# Altium project MB1936.PrjPcb (part 7 of 8)

## Sheet Power_PMIC.SchDoc: Power PMIC
size A3; Date: Not used; ApprovedBy: Not used; CheckedBy: Not used; Author: Not used; CompanyName: STMicroelectronics; DrawnBy: Not used; Engineer: Not used; Organization: Not used; Address1: Not used; Address2: Not used; Address3: Not used; Address4: Not used; DocumentNumber: Not used; Revision: Not used; SheetNumber: 4; SheetTotal: 18; CurrentTime: Not used; CurrentDate: Not used; Time: Not used; DocumentFullPathAndName: Not used; DocumentName: Not used; ModifiedDate: Not used; ImagePath: Not used; ProjectName: Not used; Application_BuildNumber: Not used
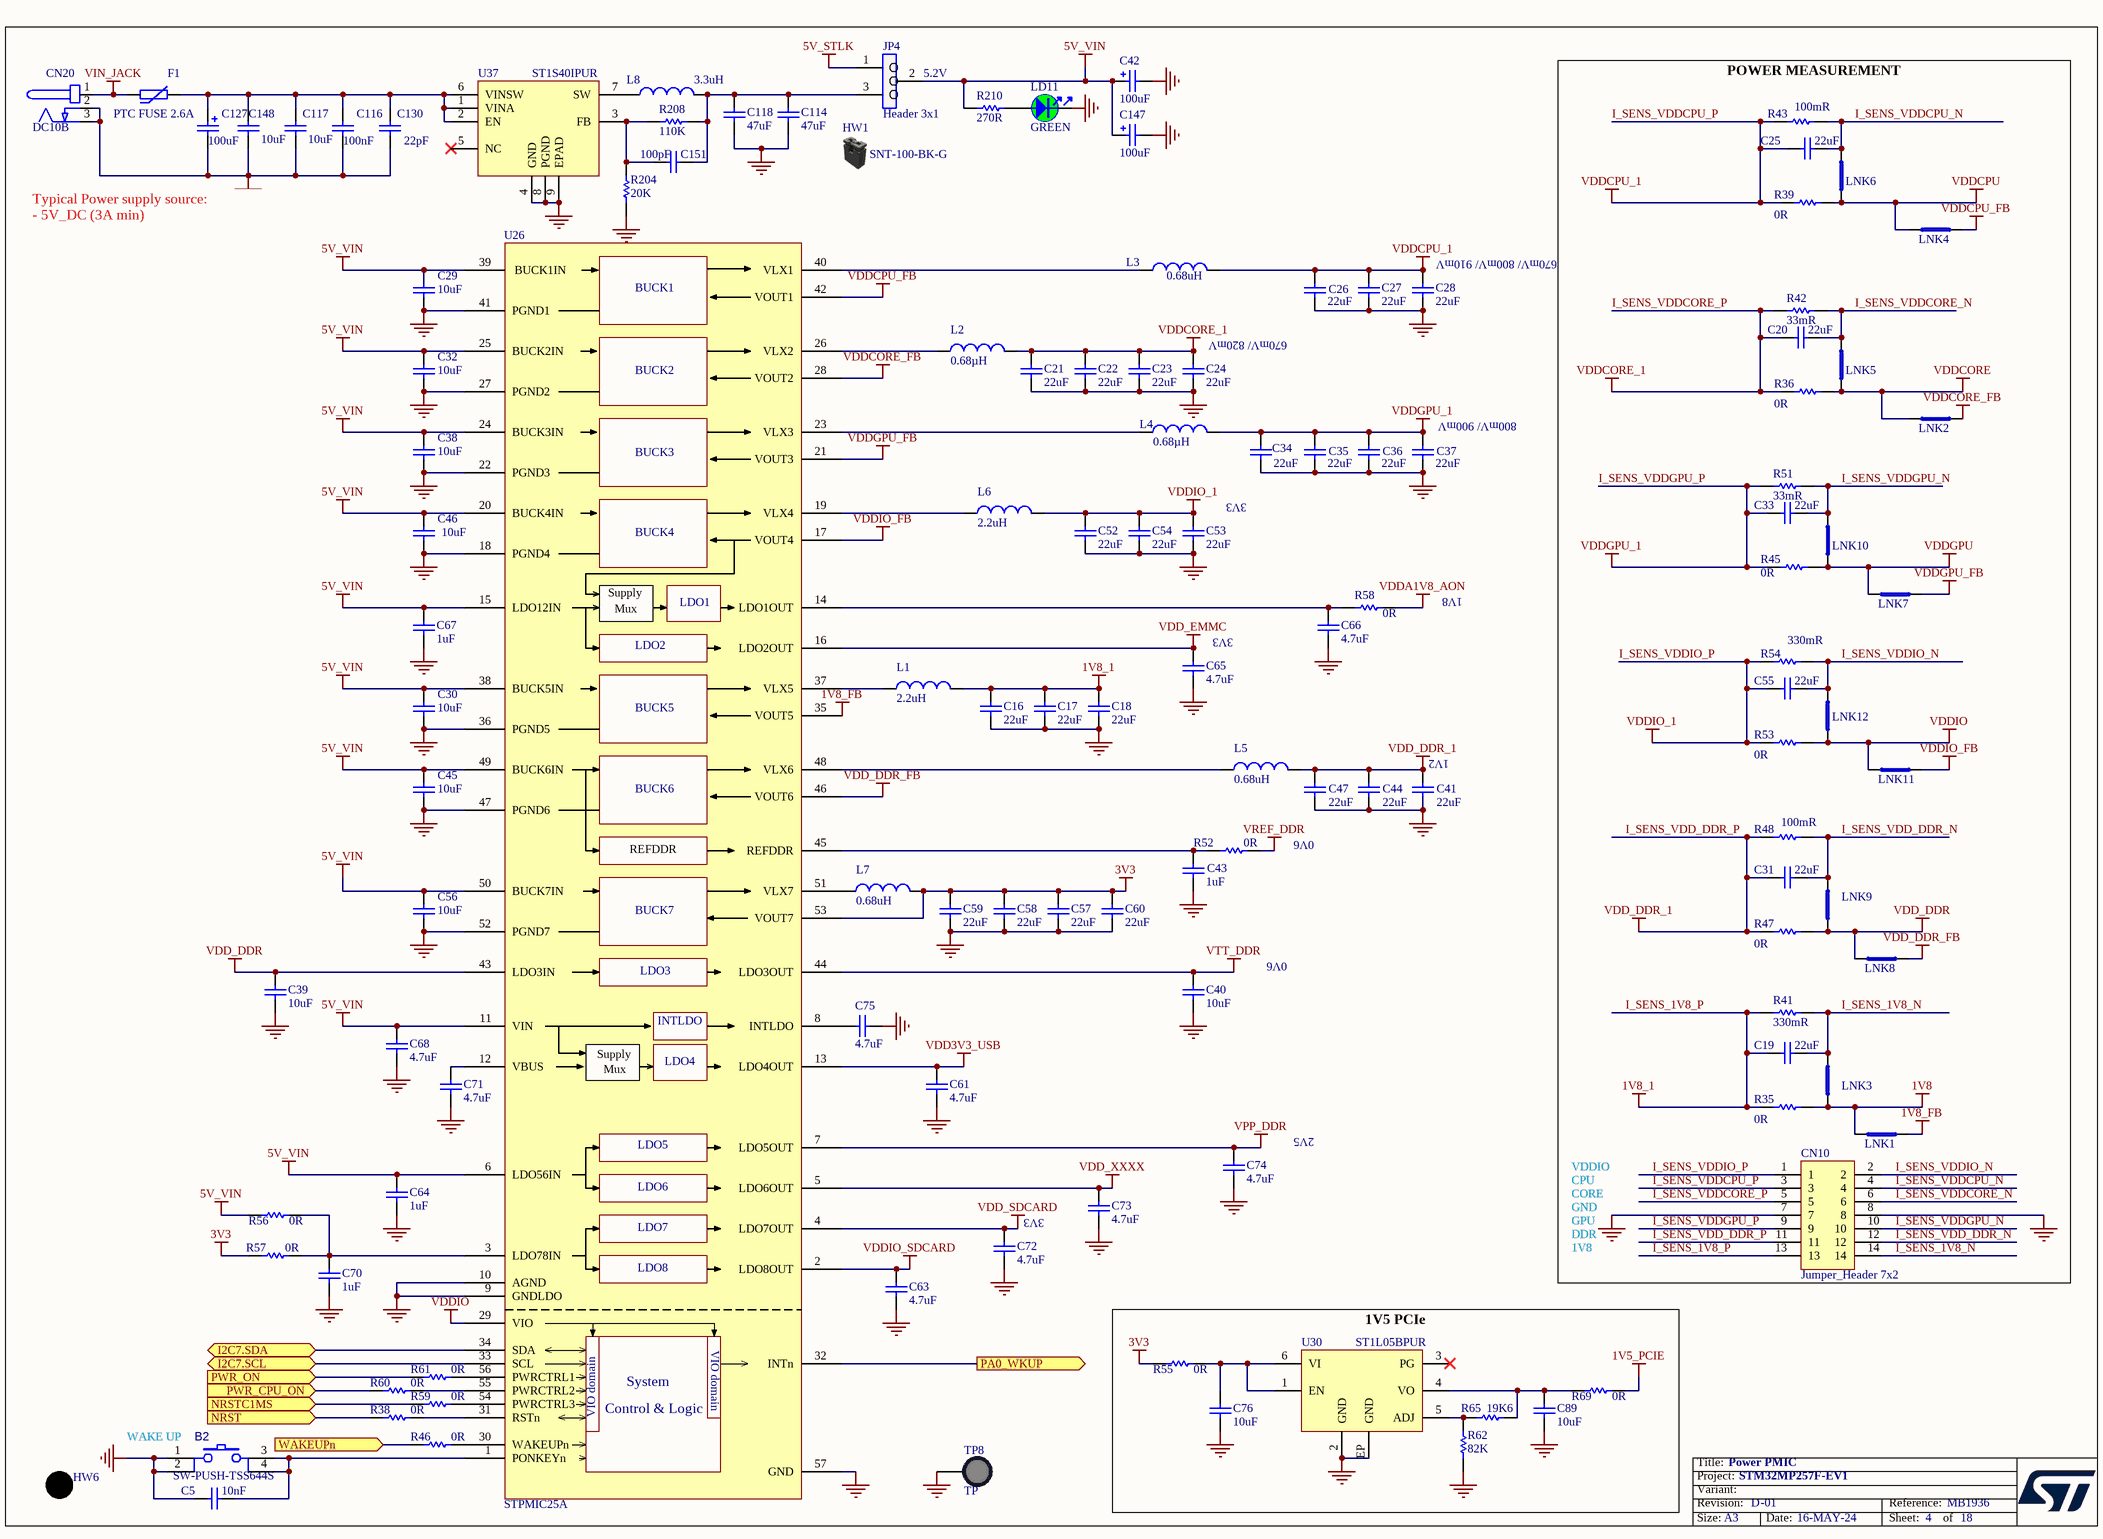
[diagram p16: Power_PMIC.SchDoc]

### Parts
B2  value SW-PUSH-TSS644S  [SWI_KNITTER_TSS644S]  (hidden comment: SW_PUSH_SMD)
C5  value 10nF  [C0402]  (hidden comment: Capacitor)
C16  value 22uF  [C0805]  (hidden comment: Capacitor)
C17  value 22uF  [C0805]  (hidden comment: Capacitor)
C18  value 22uF  [C0805]  (hidden comment: Capacitor)
C19  value 22uF  [C0603]  (hidden comment: Capacitor)
C20  value 22uF  [C0603]  (hidden comment: Capacitor)
C21  value 22uF  [C0603]  (hidden comment: Capacitor)
C22  value 22uF  [C0603]  (hidden comment: Capacitor)
C23  value 22uF  [C0603]  (hidden comment: Capacitor)
C24  value 22uF  [C0603]  (hidden comment: Capacitor)
C25  value 22uF  [C0603]  (hidden comment: Capacitor)
C26  value 22uF  [C0603]  (hidden comment: Capacitor)
C27  value 22uF  [C0603]  (hidden comment: Capacitor)
C28  value 22uF  [C0603]  (hidden comment: Capacitor)
C29  value 10uF  [C0603]  (hidden comment: Capacitor)
C30  value 10uF  [C0603]  (hidden comment: Capacitor)
C31  value 22uF  [C0603]  (hidden comment: Capacitor)
C32  value 10uF  [C0603]  (hidden comment: Capacitor)
C33  value 22uF  [C0603]  (hidden comment: Capacitor)
C34  value 22uF  [C0603]  (hidden comment: Capacitor)
C35  value 22uF  [C0603]  (hidden comment: Capacitor)
C36  value 22uF  [C0603]  (hidden comment: Capacitor)
C37  value 22uF  [C0603]  (hidden comment: Capacitor)
C38  value 10uF  [C0603]  (hidden comment: Capacitor)
C39  value 10uF  [C0402]  (hidden comment: Capacitor)
C40  value 10uF  [C0402]  (hidden comment: Capacitor)
C41  value 22uF  [C0603]  (hidden comment: Capacitor)
C42  value 100uF  [CPOL_TCJ-B_1210_H210]  (hidden comment: Cap_POL_TANA)
C43  value 1uF  [C0402]  (hidden comment: Capacitor)
C44  value 22uF  [C0603]  (hidden comment: Capacitor)
C45  value 10uF  [C0603]  (hidden comment: Capacitor)
C46  value 10uF  [C0603]  (hidden comment: Capacitor)
C47  value 22uF  [C0603]  (hidden comment: Capacitor)
C52  value 22uF  [C0805]  (hidden comment: Capacitor)
C53  value 22uF  [C0805]  (hidden comment: Capacitor)
C54  value 22uF  [C0805]  (hidden comment: Capacitor)
C55  value 22uF  [C0603]  (hidden comment: Capacitor)
C56  value 10uF  [C0603]  (hidden comment: Capacitor)
C57  value 22uF  [C0805]  (hidden comment: Capacitor)
C58  value 22uF  [C0805]  (hidden comment: Capacitor)
C59  value 22uF  [C0805]  (hidden comment: Capacitor)
C60  value 22uF  [C0805]  (hidden comment: Capacitor)
C61  value 4.7uF  [C0402]  (hidden comment: Capacitor)
C63  value 4.7uF  [C0402]  (hidden comment: Capacitor)
C64  value 1uF  [C0402]  (hidden comment: Capacitor)
C65  value 4.7uF  [C0402]  (hidden comment: Capacitor)
C66  value 4.7uF  [C0402]  (hidden comment: Capacitor)
C67  value 1uF  [C0402]  (hidden comment: Capacitor)
C68  value 4.7uF  [C0402]  (hidden comment: Capacitor)
C70  value 1uF  [C0402]  (hidden comment: Capacitor)
C71  value 4.7uF  [C0603]  (hidden comment: Capacitor)
C72  value 4.7uF  [C0402]  (hidden comment: Capacitor)
C73  value 4.7uF  [C0402]  (hidden comment: Capacitor)
C74  value 4.7uF  [C0402]  (hidden comment: Capacitor)
C75  value 4.7uF  [C0402]  (hidden comment: Capacitor)
C76  value 10uF  [C0603]  (hidden comment: Capacitor)
C89  value 10uF  [C0603]  (hidden comment: Capacitor)
C114  value 47uF  [C0805]  (hidden comment: Capacitor)
C116  value 100nF  [C0805_H0P85]  (hidden comment: Capacitor)
C117  value 10uF  [C0805]  (hidden comment: Capacitor)
C118  value 47uF  [C0805]  (hidden comment: Capacitor)
C127  value 100uF  [CPOL_WURTH_WCAP-ASLL_8X10P5]  (hidden comment: Cap_POL_TANA)
C130  value 22pF  [C0402]  (hidden comment: Capacitor)
C147  value 100uF  [CPOL_TCJ-B_1210_H210]  (hidden comment: Cap_POL_TANA)
C148  value 10uF  [C0805]  (hidden comment: Capacitor)
C151  value 100pF  [C0402]  (hidden comment: Capacitor)
CN10  value Jumper_Header 7x2  [CON_SAMTEC_TSW-107-07-X-D]  (hidden comment: Header 7x2)
CN20  DC10B  [CON_DC-POWER-SOCKET_CLIFF_FC68149_DC10B]
F1  value PTC FUSE 2.6A  [PTC_BEL-FUSE_1812_0ZCG0260FF2C]  (hidden comment: 0ZCG0260FF2C)
HW1  value SNT-100-BK-G  (hidden comment: Shunt Black 2.54mm)  (mechanical)
HW6  SW-CAP-KTSC-62K  (value not drawn)  (mechanical)
JP4  value Header 3x1  [CON_SAMTEC_TSW-103-07-F-S]  (hidden comment: Jumper_Header 3x1)
L1  value 2.2uH  [IND_2016_MURATA_LQM2MPN2R2NG0]  (hidden comment: Inductor)
L2  value 0.68µH  [IND_2520_TOKO_DFE252012P]  (hidden comment: Inductor)
L3  value 0.68uH  [IND_2016_MURATA_LQM2MPN2R2NG0]  (hidden comment: Inductor)
L4  value 0.68µH  [IND_2520_TOKO_DFE252012P]  (hidden comment: Inductor)
L5  value 0.68uH  [IND_2016_MURATA_LQM2MPN2R2NG0]  (hidden comment: Inductor)
L6  value 2.2uH  [IND_2016_MURATA_LQM2MPN2R2NG0]  (hidden comment: Inductor)
L7  value 0.68uH  [IND_2016_MURATA_LQM2MPN2R2NG0]  (hidden comment: Inductor)
L8  value 3.3uH  [IND_5040_WURTH_74404054033]  (hidden comment: Inductor)
LD11  value GREEN  [LED_0603_OSRAM_LG-Q396-PS-35_GREEN_1A2K_H0P4]  (hidden comment: LED_green)
LNK1  link_200  [LINK200]  (value not drawn)  (no BOM)
LNK2  link_200  [LINK200]  (value not drawn)  (no BOM)
LNK3  link_200  [LINK200]  (value not drawn)  (no BOM)
LNK4  link_200  [LINK200]  (value not drawn)  (no BOM)
LNK5  link_200  [LINK200]  (value not drawn)  (no BOM)
LNK6  link_200  [LINK200]  (value not drawn)  (no BOM)
LNK7  link_200  [LINK200]  (value not drawn)  (no BOM)
LNK8  link_200  [LINK200]  (value not drawn)  (no BOM)
LNK9  link_200  [LINK200]  (value not drawn)  (no BOM)
LNK10  link_200  [LINK200]  (value not drawn)  (no BOM)
LNK11  link_200  [LINK200]  (value not drawn)  (no BOM)
LNK12  link_200  [LINK200]  (value not drawn)  (no BOM)
R35  value 0R  [R0603]  (hidden comment: Resistor)
R36  value 0R  [R0603]  (hidden comment: Resistor)
R38  value 0R  [R0402]
R39  value 0R  [R0603]  (hidden comment: Resistor)
R41  value 330mR  [R0603]  (hidden comment: Resistor)
R42  value 33mR  [R0603]  (hidden comment: Resistor)
R43  value 100mR  [R0603]  (hidden comment: Resistor)
R45  value 0R  [R0603]  (hidden comment: Resistor)
R46  value 0R  [R0402]
R47  value 0R  [R0603]  (hidden comment: Resistor)
R48  value 100mR  [R0603]  (hidden comment: Resistor)
R51  value 33mR  [R0603]  (hidden comment: Resistor)
R52  value 0R  [R0402]  (hidden comment: Resistor)
R53  value 0R  [R0603]  (hidden comment: Resistor)
R54  value 330mR  [R0603]  (hidden comment: Resistor)
R55  value 0R  [R0603]  (hidden comment: Resistor)
R56  value 0R  [R0603]  (hidden comment: Resistor)
R57  value 0R  [R0402]  (hidden comment: Resistor)
R58  value 0R  [R0603]  (hidden comment: Resistor)
R59  value 0R  [R0402]
R60  value 0R  [R0402]
R61  value 0R  [R0402]
R62  value 82K  [R0402]  (hidden comment: Resistor)
R65  value 19K6  [R0402]  (hidden comment: Resistor)
R69  value 0R  [R0603]  (hidden comment: Resistor)
R204  value 20K  [R0402]  (hidden comment: Resistor)
R208  value 110K  [R0402]  (hidden comment: Resistor)
R210  value 270R  [R0402]  (hidden comment: Resistor)
TP8  value TP  [TP_PTH-1P02MM_TEST-TERMINAL_RS_101-2391_BLACK]  (hidden comment: Test_pin_conn_black)
U26  value STPMIC25A  [ICC_QFN56-EPAD_6P5X6P5_P040]  (hidden comment: STPMIC2)
U30  ST1L05BPUR  [ICC_DFN6-EPAD_3X3_P095]
U37  ST1S40IPUR  [ICC_VFQFPN8-EPAD_4X4_P080]

### Ports
I2C7.SCL (bidir), I2C7.SDA (bidir), NRST (in), NRSTC1MS (in), PA0_WKUP (out), PWR_CPU_ON (in), PWR_ON (in), WAKEUPn (in)

### Nets
1V5_PCIE: R69.2
1V8: LNK1.2 LNK3.2 R35.2
1V8_FB: LNK1.1 U26.35(VOUT5)
3V3: C57.2 C58.2 C59.2 C60.2 L7.2 R55.1 R57.1 U26.53(VOUT7)
5V_STLK: JP4.1
5V_VIN: C29.2 C30.2 C32.2 C38.2 C42.1 C45.2 C46.2 C56.2 C64.2 C67.2 C68.2 C147.1 JP4.2 R56.1 R210.2 U26.6(LDO56IN) U26.11(VIN) U26.15(LDO12IN) U26.20(BUCK4IN) U26.24(BUCK3IN) U26.25(BUCK2IN) U26.38(BUCK5IN) U26.39(BUCK1IN) U26.49(BUCK6IN) U26.50(BUCK7IN)
GND: B2.1 B2.2 C5.1 C16.1 C17.1 C18.1 C21.1 C22.1 C23.1 C24.1 C26.1 C27.1 C28.1 C29.1 C30.1 C32.1 C34.1 C35.1 C36.1 C37.1 C38.1 C39.1 C40.1 C41.1 C42.2 C43.2 C44.1 C45.1 C46.1 C47.1 C52.1 C53.1 C54.1 C56.1 C57.1 C58.1 C59.1 C60.1 C61.1 C63.2 C64.1 C65.2 C66.1 C67.1 C68.1 C70.1 C71.1 C72.2 C73.2 C74.2 C75.2 C76.1 C89.1 C114.1 C116.1 C117.1 C118.1 C127.2 C130.1 C147.2 C148.1 CN10.7 CN10.8 CN20.2 CN20.3 LD11.2 R62.1 R204.1 TP8.1 U26.9(GNDLDO) U26.10(AGND) U26.18(PGND4) U26.22(PGND3) U26.27(PGND2) U26.36(PGND5) U26.41(PGND1) U26.47(PGND6) U26.52(PGND7) U26.57(GND) U30.2(GND) U30.EP(GND) U37.4(GND) U37.8(PGND) U37.9(EPAD)
I_SENS_1V8_P: C16.2 C17.2 C18.2 C19.2 CN10.13 L1.2 R35.1 R41.1  [also labelled 1V8_1]
I_SENS_VDD_DDR_P: C31.2 C41.2 C44.2 C47.2 CN10.11 L5.2 R47.1 R48.1  [also labelled VDD_DDR_1]
I_SENS_VDDCORE_P: C20.2 C21.2 C22.2 C23.2 C24.2 CN10.5 L2.2 R36.1 R42.1  [also labelled VDDCORE_1]
I_SENS_VDDCPU_P: C25.2 C26.2 C27.2 C28.2 CN10.3 L3.2 R39.1 R43.1  [also labelled VDDCPU_1]
I_SENS_VDDGPU_P: C33.2 C34.2 C35.2 C36.2 C37.2 CN10.9 L4.2 R45.1 R51.1  [also labelled VDDGPU_1]
I_SENS_VDDIO_P: C52.2 C53.2 C54.2 C55.2 CN10.1 L6.2 R53.1 R54.1  [also labelled VDDIO_1]
VDD3V3_USB: C61.2 U26.13(LDO4OUT)
VDD_DDR: C39.2 LNK8.2 LNK9.2 R47.2 U26.43(LDO3IN)
VDD_DDR_FB: LNK8.1 U26.46(VOUT6)
VDD_EMMC: C65.1 U26.16(LDO2OUT)
VDD_SDCARD: C72.1 U26.4(LDO7OUT)
VDD_XXXX: C73.1 U26.5(LDO6OUT)
VDDA1V8_AON: R58.2
VDDCORE: LNK2.2 LNK5.1 R36.2
VDDCORE_FB: LNK2.1 U26.28(VOUT2)
VDDCPU: LNK4.1 LNK6.1 R39.2
VDDCPU_FB: LNK4.2 U26.42(VOUT1)
VDDGPU: LNK7.2 LNK10.1 R45.2
VDDGPU_FB: LNK7.1 U26.21(VOUT3)
VDDIO: LNK11.2 LNK12.2 R53.2 U26.29(VIO)
VDDIO_FB: LNK11.1 U26.17(VOUT4)
VDDIO_SDCARD: C63.1 U26.2(LDO8OUT)
VIN_JACK: CN20.1 F1.1
VPP_DDR: C74.1 U26.7(LDO5OUT)
VREF_DDR: R52.2
VTT_DDR: C40.2 U26.44(LDO3OUT)
I2C7.SCL: U26.33(SCL) ; port I2C7.SCL
I2C7.SDA: U26.34(SDA) ; port I2C7.SDA
I_SENS_1V8_N: C19.1 CN10.14 LNK3.1 R41.2
I_SENS_VDD_DDR_N: C31.1 CN10.12 LNK9.1 R48.2
I_SENS_VDDCORE_N: C20.1 CN10.6 LNK5.2 R42.2
I_SENS_VDDCPU_N: C25.1 CN10.4 LNK6.2 R43.2
I_SENS_VDDGPU_N: C33.1 CN10.10 LNK10.2 R51.2
I_SENS_VDDIO_N: C55.1 CN10.2 LNK12.1 R54.2
NRST: R38.1 ; port NRST
NRSTC1MS: R59.1 ; port NRSTC1MS
PA0_WKUP: U26.32(INTn) ; port PA0_WKUP
PWR_CPU_ON: R60.1 ; port PWR_CPU_ON
PWR_ON: R61.1 ; port PWR_ON
WAKEUPn: R46.1 ; port WAKEUPn
NetB2_3: B2.3 B2.4 C5.2 U26.1(PONKEYn)
NetC43_1: C43.1 R52.1 U26.45(REFDDR)
NetC66_2: C66.2 R58.1 U26.14(LDO1OUT)
NetC70_2: C70.2 R56.2 R57.2 U26.3(LDO78IN)
NetC71_2: C71.2 U26.12(VBUS)
NetC75_1: C75.1 U26.8(INTLDO)
NetC76_2: C76.2 R55.2 U30.1(EN) U30.6(VI)
NetC89_2: C89.2 R65.2 R69.1 U30.4(VO)
NetC114_2: C114.2 C118.2 C151.1 JP4.3 L8.2 R208.1
NetC116_2: C116.2 C117.2 C127.1 C130.2 C148.2 F1.2 U37.1(VINA) U37.2(EN) U37.6(VINSW)
NetC151_2: C151.2 R204.2 R208.2 U37.3(FB)
NetL1_1: L1.1 U26.37(VLX5)
NetL2_1: L2.1 U26.26(VLX2)
NetL3_1: L3.1 U26.40(VLX1)
NetL4_1: L4.1 U26.23(VLX3)
NetL5_1: L5.1 U26.48(VLX6)
NetL6_1: L6.1 U26.19(VLX4)
NetL7_1: L7.1 U26.51(VLX7)
NetL8_1: L8.1 U37.7(SW)
NetLD11_1: LD11.1 R210.1
NetR38_2: R38.2 U26.31(RSTn)
NetR46_2: R46.2 U26.30(WAKEUPn)
NetR59_2: R59.2 U26.54(PWRCTRL3)
NetR60_2: R60.2 U26.55(PWRCTRL2)
NetR61_2: R61.2 U26.56(PWRCTRL1)
NetR62_2: R62.2 R65.1 U30.5(ADJ)

Not connected (* = marked no-connect by the designer): U30 3(PG)*; U37 5(NC)*

### Notes on the sheet
- 5.2V
- Typical Power supply source:
  - 5V_DC (3A min)
- (near C28) 670mV/ 800mV/ 910mV
- (near C24) 670mV/ 820mV
- (near C37) 800mV/ 900mV
- 3V3
- 1V8
- (near C65) 3V3
- (near C41) 1V2
- 0V6
- 2V5
- (near C72) 3V3
- VDDIO
- CPU
- GND
- CORE
- POWER MEASUREMENT
- DDR
- GPU
- (near B2) WAKE UP
- 1V5 PCIe
- Title:
- Project:
- Size:
- Revision:
- Variant:
- A3
- -
- Date:
- Reference:
- Sheet:
- of
- (in symbol MCD-03000) BUCK1; BUCK2; BUCK3; BUCK4; Supply; LDO1; Mux; LDO2; BUCK5; BUCK6; BUCK7; LDO3; LDO4; LDO5; LDO6; LDO7; LDO8; VIO domain; System; Control & Logic

### Library data of the parts
B2 = MCD-02417: Push Button, NO, 0.05A, 12V, 2.6N, SMD, 9.0x6.2mm, T=7.3mm, changeable caps KTSC-6xx; Part_Type: Misc; Manufacturer_Part_Number: TSS644S; Manufacturer: KNITTER-SWITCH; Part_Preference: Recommended; Component_Country_Of_Origin: China; ShowFields: YES; ID: 4523; Internal_Part_Number: MCD-02417; Status: Released; ComponentLink1URL: http://tunmcdsvn.tun.st.com/Component_Documentation_Library/Trunk/Misc/KNITTER_TSS6x_Series; Order_Code_Digikey: N/A; Order_Code_Farnell: N/A; Order_Code_RS: N/A; Package: 9.0x6.2mm
C5 = MCD-02198: Capacitor, MLCC, 10nF, 50V, X7R, +/-10%, 0402, T=0.5mm; Manufacturer_Part_Number: CC0402KRX7R9BB103; Manufacturer: YAGEO; Part_Preference: Recommended; Order_Code_RS: 6169644; Component_Country_Of_Origin: China; ShowFields: YES; ID: 4298; Internal_Part_Number: MCD-02198; Status: Checked; Part_Type: Capacitor; Package: 0402; ComponentLink1URL: http://tunmcdsvn.tun.st.com/Component_Documentation_Library/Trunk/Capacitor/YAGEO_X7R_Series; Order_Code_Digikey: N/A; Order_Code_Farnell: N/A
C16-C18 C52-C54 C57-C60 = MCD-03139: Capacitor, MLCC, 22uF, 10V, X5R, +/-20%, 0805, T=1,25mm; Part_Preference: Recommended; Manufacturer: MURATA; Manufacturer_Part_Number: GRM21BR61A226ME51L; ShowFields: YES; ID: 5255; Internal_Part_Number: MCD-03139; Status: New; Part_Type: Capacitor; Package: 0805; ComponentLink1URL: http://tunmcdsvn.tun.st.com/Component_Documentation_Library/Trunk/Capacitor/MURATA_GRM_Series; Order_Code_Digikey: 490-10511-2-ND; Order_Code_Farnell: 2494270; Order_Code_RS: N/A
C19 C20 C22-C26 C31 C33-C37 C41 C44 C47 C55 = MCD-00100: Capacitor, MLCC, 22uF, 6V3, X5R, +/-20%, 0603, T=0,8mm; Manufacturer_Part_Number: GRM188R60J226MEA0J; Manufacturer: MURATA; Part_Preference: Recommended; Component_Country_Of_Origin: Japan; ID: 2766; ShowFields: YES; Internal_Part_Number: MCD-00100; Status: Released; Part_Type: Capacitor; Package: 0603; ComponentLink1Description: Part_Information; ComponentLink1URL: http://tunmcdsvn.tun.st.com/Component_Documentation_Library/Trunk/Capacitor/MURATA_GRM_Series; Order_Code_Digikey: 490-7612-2-ND; Order_Code_Farnell: N/A; Order_Code_RS: N/A; Alternate_Manufacturer: N/A; Alternate_Manufacturer_Part_Number: N/A
C21 C27 C28 = MCD-00100: Capacitor, MLCC, 22uF, 6V3, X5R, +/-20%, 0603, T=0,8mm; Part_Preference: Recommended; Manufacturer: MURATA; Manufacturer_Part_Number: GRM188R60J226MEA0J; Component_Country_Of_Origin: Japan; ID: 2766; ShowFields: YES; Internal_Part_Number: MCD-00100; Status: Released; Part_Type: Capacitor; Package: 0603; ComponentLink1URL: http://tunmcdsvn.tun.st.com/Component_Documentation_Library/Trunk/Capacitor/MURATA_GRM_Series; Order_Code_Digikey: 490-7612-2-ND; Order_Code_Farnell: N/A; Order_Code_RS: N/A; ComponentLink1Description: Part_Information; Alternate_Manufacturer: N/A; Alternate_Manufacturer_Part_Number: N/A
C29 C30 C32 C38 C45 C46 C56 = MCD-00099: Capacitor, MLCC, 10uF, 10V, X5R, +/-10%, 0603, T=0,8mm; Manufacturer_Part_Number: GRM188R61A106KE69D; Manufacturer: MURATA; Part_Preference: Recommended; Order_Code_RS: 170-6168; Component_Country_Of_Origin: Japan; ID: 2770; ShowFields: YES; Internal_Part_Number: MCD-00099; Status: Released; Part_Type: Capacitor; Package: 0603; ComponentLink1Description: Part_Information; ComponentLink1URL: http://tunmcdsvn.tun.st.com/Component_Documentation_Library/Trunk/Capacitor/MURATA_GRM_Series; Order_Code_Digikey: 490-10474-1-ND; Order_Code_Farnell: 2494233; Alternate_Manufacturer: N/A; Alternate_Manufacturer_Part_Number: N/A
C39 C40 = MCD-03140: Capacitor, MLCC, 10uF, 6.3V, X5R, +/-20%, 0402, T=0.5mm; Part_Preference: Recommended; Manufacturer: MURATA; Manufacturer_Part_Number: GRM155R60J106ME05D; ShowFields: YES; ID: 5256; Internal_Part_Number: MCD-03140; Status: New; Part_Type: Capacitor; Package: 0402; ComponentLink1URL: http://tunmcdsvn.tun.st.com/Component_Documentation_Library/Trunk/Capacitor/MURATA_GRM_Series; Order_Code_Digikey: 490-GRM155R60J106ME05DTR-ND; Order_Code_Farnell: 3784428; Order_Code_RS: N/A
C42 C147 = MCD-01796: Capacitor, Tantalum, 100uF, 6V3, 40mR, +/-20%,  Type_B (3528 metric), T=1.9mm; Part_Preference: Recommended; Manufacturer: AVX; Manufacturer_Part_Number: TCJB107M006R0040; Component_Country_Of_Origin: Lanskroun; ShowFields: YES; ID: 3896; Revision: July-2002: Re-released for DXP Platform.; Internal_Part_Number: MCD-01796; Status: Released; Part_Type: Capacitor; Package: 3528 (metric); ComponentLink1URL: http://tunmcdsvn.tun.st.com/Component_Documentation_Library/Trunk/Capacitor/AVX_TCJ_Series; Order_Code_Digikey: 478-9994-2-ND; Order_Code_Farnell: 2728622; Order_Code_RS: N/A
C43 = MCD-01722: Capacitor, MLCC, 1uF, 10V, X5R, +/-10%, 0402, T=0.5mm; Part_Preference: Recommended; Manufacturer: YAGEO; Manufacturer_Part_Number: CC0402KRX5R6BB105; Component_Country_Of_Origin: China; ID: 3822; ShowFields: YES; Internal_Part_Number: MCD-01722; Status: Released; Part_Type: Capacitor; Alternate_Manufacturer: N/A; Alternate_Manufacturer_Part_Number: N/A; Package: 0402; ComponentLink1URL: http://tunmcdsvn.tun.st.com/Component_Documentation_Library/Trunk/Capacitor/YAGEO_X5R_Series; Order_Code_Digikey: 311-1439-1-ND; Order_Code_Farnell: 1458896; Order_Code_RS: N/A
C61 C63 C65 C66 C68 C72-C75 = MCD-01356: Capacitor, MLCC, 4.7uF, 6V3, X5R, +/-20%, 0402, T=0.5mm; Manufacturer_Part_Number: GRM155R60J475ME47; Manufacturer: MURATA; Part_Preference: Recommended; Order_Code_RS: 814-5230; Component_Country_Of_Origin: Japan; ShowFields: YES; ID: 3456; Internal_Part_Number: MCD-01356; Status: Released; Part_Type: Capacitor; Package: 0402; ComponentLink1URL: http://tunmcdsvn.tun.st.com/Component_Documentation_Library/Trunk/Capacitor/MURATA_GRM_Series; Order_Code_Digikey: 490-5915-1-ND; Order_Code_Farnell: 2666407
C64 C67 C70 = MCD-00095: Capacitor, MLCC, 1uF, 25V, X5R, +/-10%, 0402, T=0.5mm; Part_Preference: Recommended; Manufacturer: MURATA; Manufacturer_Part_Number: GRM155R61E105KA12; Order_Code_RS: 846-7287; Component_Country_Of_Origin: Japan; ShowFields: YES; ID: 2772; Internal_Part_Number: MCD-00095; Status: Released; Part_Type: Capacitor; Package: 0402; ComponentLink1URL: http://tunmcdsvn.tun.st.com/Component_Documentation_Library/Trunk/Capacitor/MURATA_GRM_Series; Order_Code_Digikey: 490-10017-1-ND; Order_Code_Farnell: 2218855
C71 = MCD-00097: Capacitor, MLCC, 4.7uF, 16V, X5R, +/-20%, 0603, T=0.8mm; Part_Preference: Recommended; Manufacturer: MURATA; Manufacturer_Part_Number: GRM188R61C475KE11; Component_Country_Of_Origin: Japan; ShowFields: YES; ID: 2767; Internal_Part_Number: MCD-00097; Status: Released; Part_Type: Capacitor; Package: 0603; ComponentLink1URL: http://tunmcdsvn.tun.st.com/Component_Documentation_Library/Trunk/Capacitor/MURATA_GRM_Series; Order_Code_Digikey: 490-10730-1-ND; Order_Code_Farnell: N/A; Order_Code_RS: N/A
C76 C89 = MCD-00099: Capacitor, MLCC, 10uF, 10V, X5R, +/-10%, 0603, T=0.8mm; Part_Preference: Recommended; Manufacturer: MURATA; Manufacturer_Part_Number: GRM188R61A106KE69D; Order_Code_RS: 170-6168; Component_Country_Of_Origin: Japan; ShowFields: YES; ID: 2770; Internal_Part_Number: MCD-00099; Status: Released; Part_Type: Capacitor; Package: 0603; ComponentLink1URL: http://tunmcdsvn.tun.st.com/Component_Documentation_Library/Trunk/Capacitor/MURATA_GRM_Series; Order_Code_Digikey: 490-10474-1-ND; Order_Code_Farnell: 2494233
C114 C118 = MCD-00204: Capacitor, MLCC, 47uF, 10V, X5R, +/-20%, 0805, T=1,25mm; Part_Preference: Recommended; Manufacturer: MURATA; Manufacturer_Part_Number: GRM21BR61A476ME15K; Component_Country_Of_Origin: Japan; ID: 2664; ShowFields: YES; Internal_Part_Number: MCD-00204; Status: Checked; Part_Type: Capacitor; Alternate_Manufacturer: N/A; Alternate_Manufacturer_Part_Number: N/A; Package: 0805; ComponentLink1Description: Part_Information; ComponentLink1URL: http://tunmcdsvn.tun.st.com/Component_Documentation_Library/Trunk/Capacitor/MURATA_GRM_Series; Order_Code_Digikey: GRM21BR61A476ME15K-ND; Order_Code_Farnell: N/A; Order_Code_RS: N/A
C116 = MCD-01525: Capacitor, MLCC, 100nF, 50V, X7R, 10%, 0805, T=0,85mm; BMS_Part_Number: 9142249; Part_Preference: Recommended; Manufacturer: YAGEO; Manufacturer_Part_Number: CC0805KRX7R9BB104; Order_Code_RS: 669-8842; Component_Country_Of_Origin: China; ID: 3625; ShowFields: YES; Internal_Part_Number: MCD-01525; Status: Released; Part_Type: Capacitor; Package: 0805; ComponentLink1Description: Part_Information; ComponentLink1URL: http://tunmcdsvn.tun.st.com/Component_Documentation_Library/Trunk/Capacitor/YAGEO_X7R_Series; Order_Code_Digikey: 311-1140-1-ND; Order_Code_Farnell: 3019949; Alternate_Manufacturer: N/A; Alternate_Manufacturer_Part_Number: N/A
C117 C148 = MCD-00014: Capacitor, MLCC, 10uF, 25V, X5R, +/-10%, 0805, T=0,85mm; Part_Preference: Recommended; Manufacturer: YAGEO; Manufacturer_Part_Number: CC0805KRX5R8BB106; Full_Alternate_Internal_Part_Number: MCD-02385; Component_Country_Of_Origin: China; ID: 2468; ShowFields: YES; Internal_Part_Number: MCD-00014; Status: Released; Part_Type: Capacitor; Package: 0805; ComponentLink1Description: Part_Information; ComponentLink1URL: http://tunmcdsvn.tun.st.com/Component_Documentation_Library/Trunk/Capacitor/YAGEO_X5R_Series; Order_Code_Digikey: 311-3503-1-ND; Order_Code_Farnell: N/A; Order_Code_RS: N/A; Alternate_Manufacturer: N/A; Alternate_Manufacturer_Part_Number: N/A
C127 = MCD-01683: Capacitor,Electrolytic,100uF,35V, 20%, SMT, D=8mm, T=10.5mm; Part_Preference: Recommended; Manufacturer: WURTH ELEKTRONIK; Manufacturer_Part_Number: 865060553006; Order_Code_RS: 839-5753; Component_Country_Of_Origin: Unknown; ID: 3783; ShowFields: YES; Revision: July-2002: Re-released for DXP Platform.; Internal_Part_Number: MCD-01683; Status: Released; Part_Type: Capacitor; Package: 8x10.5mm; ComponentLink1Description: Part_Information; ComponentLink1URL: http://tunmcdsvn.tun.st.com/Component_Documentation_Library/Trunk/Capacitor/WURTH-ELEKTRONIC_ASLL_Series; Order_Code_Digikey: 732-8586-1-ND; Order_Code_Farnell: 2466219; Alternate_Manufacturer: N/A; Alternate_Manufacturer_Part_Number: N/A
C130 = MCD-01995: Capacitor, MLCC, 22pF, 50V, C0G, 5%, 0402, T=0,5mm; Part_Preference: Recommended; Manufacturer: TDK; Manufacturer_Part_Number: C1005NP01H220J050BA; Component_Country_Of_Origin: Unknown; ID: 4095; ShowFields: YES; Internal_Part_Number: MCD-01995; Status: Released; Part_Type: Capacitor; Package: 0402; ComponentLink1Description: Part_Information; ComponentLink1URL: http://tunmcdsvn.tun.st.com/Component_Documentation_Library/Trunk/Capacitor/TDK_C_Series; Order_Code_Digikey: 445-13793-1-ND; Alternate_Manufacturer: N/A; Alternate_Manufacturer_Part_Number: N/A; Order_Code_Farnell: 3416050RL; Order_Code_RS: N/A
C151 = MCD-00205: Capacitor,MLCC,100pF,50V,NPO,+/-5%,0402,T=0,5mm; Manufacturer_Part_Number: CC0402JRNPO9BN101; Manufacturer: YAGEO; Part_Preference: Recommended; Fitted: YES; Component_Country_Of_Origin: China; ID: 2658; Internal_Part_Number: MCD-00205; Status: Released; Part_Type: Capacitor; Package: 0402; ComponentLink1Description: Part_Information; ComponentLink1URL: http://tunmcdsvn.tun.st.com/Component_Documentation_Library/Trunk/Capacitor/YAGEO_NP0_Series; Order_Code_Digikey: 311-1024-1-ND; Order_Code_Farnell: 3019226RL; Order_Code_RS: N/A; Alternate_Manufacturer: N/A; Alternate_Manufacturer_Part_Number: N/A; ShowFields: YES
CN10 = MCD-02123: Header, 7x2, 2,54mm, VR, TH, Height 5.84mm/2.54mm; Part_Type: Connector; Part_Preference: Recommended; Manufacturer: SAMTEC; Manufacturer_Part_Number: TSW-107-07-G-D; Component_Country_Of_Origin: China, Costa Rica, Malaysia, United States, Vietnam; ID: 4223; ShowFields: YES; Internal_Part_Number: MCD-02123; Status: Checked; Alternate_Manufacturer: N/A; Alternate_Manufacturer_Part_Number: N/A; ComponentLink1URL: http://tunmcdsvn.tun.st.com/Component_Documentation_Library/Trunk/Connector/SAMTEC_TSW_Series/; Order_Code_Digikey: N/A; Order_Code_Farnell: N/A; Order_Code_RS: N/A; ComponentLink1Description: Part_Information
CN20 = MCD-00173: DC-Power-Jack, 2.5mm, 5A, RA, TH; BMS_Part_Number: 9087803; Part_Preference: Recommended; Part_Type: Connector; Manufacturer: CLIFF; Value: Jack_DC-Power_DC10B; Component_Country_Of_Origin: Taiwan; ID: 2695; ShowFields: YES; Internal_Part_Number: MCD-00173; Status: Released; Manufacturer_Part_Number: DC10B; ComponentLink1Description: Part_Information; ComponentLink1URL: http://tunmcdsvn.tun.st.com/Component_Documentation_Library/Trunk/Connector/CLIFF_DC_Series/; Alternate_Manufacturer: N/A; Alternate_Manufacturer_Part_Number: N/A; Order_Code_Digikey: N/A; Order_Code_Farnell: 224960; Order_Code_RS: N/A
F1 = MCD-00624: SMD, PTC resettable fuse, IH:2.6A, IT:5A, Vdc_max:8V, Rmax:47mohm, BELFUSE; Part_Preference: Recommended; Part_Type: Misc; Component_Country_Of_Origin: Unknown; ID: 3118; ShowFields: YES; Internal_Part_Number: MCD-00624; Status: Checked; Manufacturer: BELFUSE; Manufacturer_Part_Number: 0ZCG0260FF2C; ComponentLink1Description: Part_Information; ComponentLink1URL: http://tunmcdsvn.tun.st.com/Component_Datasheet_Library/Trunk/Misc/BELFUSE_FUSE_PTC_0ZCG_series
HW1 = MCD-00043: SHUNT 2.54mm BLACK; Part_Type: Misc; Part_Preference: Recommended; Manufacturer: SAMTEC; Full_Alternate_Internal_Part_Number: MCD-02388; Component_Country_Of_Origin: China, Costa Rica, Malaysia, United States, Vietnam; ShowFields: YES; ID: 2551; Internal_Part_Number: MCD-00043; Status: Released; Manufacturer_Part_Number: SNT-100-BK-G; ComponentLink1URL: http://tunmcdsvn.tun.st.com/Component_Datasheet_Library/Trunk/Connectors/Samtec_Shunt_Jumper_SNT100
HW6 = MCD-02420: Black round cap for TSS6x series; Part_Type: Mechanical; Part_Preference: Recommended; Manufacturer: KNITTER-SWITCH; Component_Country_Of_Origin: China; ID: 4526; ShowFields: YES; Value: SW-CAP-KTSC-62K; Order_code_Digikey: N/A; Order_code_Farnell: N/A; Order_code_RS: N/A; Status: Released; ComponentLink1URL: http://tunmcdsvn.tun.st.com/Component_Documentation_Library/Trunk/Mechanical/KNITTER-SWITCH_KTSC-62_Series; Internal_Part_Number: MCD-02420; Manufacturer_Part_Number: KTSC-62K; Alternate_Manufacturer: N/A; Alternate_Manufacturer_Part_Number: N/A
JP4 = MCD-00111: Header, 3x1, 2.54mm, VR, TH, T=5.84mm/2.54mm; Part_Type: Connector; Part_Preference: Recommended; Manufacturer: SAMTEC; Manufacturer_Part_Number: TSW-103-07-F-S; Order_Code_RS: 161-2248; Component_Country_Of_Origin: China, Costa Rica, Malaysia, United States, Vietnam; ShowFields: YES; ID: 2760; Internal_Part_Number: MCD-00111; Status: Released; ComponentLink1URL: http://tunmcdsvn.tun.st.com/Component_Documentation_Library/Trunk/Connector/SAMTEC_TSW_Series/; Order_Code_Digikey: SAM8995-ND; Order_Code_Farnell: 2505043
L1 L6 = MCD-03143: Inductor, 2.2uH, +/-20%, Itemp= 1700mA, Isat= 2400mA, 0R140, 0806, T=1mm; Part_Preference: Recommended; Manufacturer: MURATA; Manufacturer_Part_Number: DFE201610E-2R2M=P2; ShowFields: YES; ID: 5259; Internal_Part_Number: MCD-03143; Status: New; Part_Type: Inductor; Package: 0806; ComponentLink1URL: http://tunmcdsvn.tun.st.com/Component_Documentation_Library/Trunk; Order_Code_Digikey: 490-17728-2-ND -; Order_Code_Farnell: N/A; Order_Code_RS: N/A
L2 L4 = MCD-03142: Inductor, 0.68uH, +/-20%, Itemp= 3900mA, Isat= 5400mA, 0R031, 1008, T=1.2mm; Part_Preference: Recommended; Manufacturer: MURATA; Manufacturer_Part_Number: DFE252012F-R68M=P2; ShowFields: YES; ID: 5258; Internal_Part_Number: MCD-03142; Status: New; Part_Type: Inductor; Package: 1008; ComponentLink1URL: http://tunmcdsvn.tun.st.com/Component_Documentation_Library/Trunk/Inductor/MURATA_DFE252012F; Order_Code_Digikey: 490-13044-2-ND; Order_Code_Farnell: N/A; Order_Code_RS: N/A
L3 L5 L7 = MCD-03141: Inductor, 0.68uH, +/-20%, Itemp= 3100mA, Isat= 4300mA, 0R043, 0806, T=1mm; Part_Preference: Recommended; Manufacturer: MURATA; Manufacturer_Part_Number: DFE201610E-R68M=P2; ShowFields: YES; ID: 5257; Internal_Part_Number: MCD-03141; Status: New; Part_Type: Inductor; Package: 0806; ComponentLink1URL: http://tunmcdsvn.tun.st.com/Component_Documentation_Library/Trunkhttp://tunmcdsvn.tun.st.com/Component_Documentation_Library/Trunk/Inductor/MURATA_DFE201612P_Series; Order_Code_Digikey: N/A; Order_Code_Farnell: N/A; Order_Code_RS: N/A
L8 = MCD-02220: Fixed Inductors WE-LQS 5040 3.3uH 3.4A 24mOhm; Part_Preference: Recommended; Manufacturer: WURTH ELEKTRONIK; Manufacturer_Part_Number: 74404054033; Order_Code_RS: 814-2571; Component_Country_Of_Origin: Unknown; ID: 4320; ShowFields: YES; Internal_Part_Number: MCD-02220; Status: Checked; Part_Type: Inductor; Package: 5040; ComponentLink1Description: Part_Information; ComponentLink1URL: http://tunmcdsvn.tun.st.com/Component_Documentation_Library/Trunk/Inductor/WURTH_ELEKTRONIK_74404054033; Alternate_Manufacturer: N/A; Alternate_Manufacturer_Part_Number: N/A; Order_Code_Digikey: 732-5516-1-ND; Order_Code_Farnell: 2431504
LD11 = MCD-00588: LED Green, 0603 SMD, Forward Voltage Typ=2V, Max=2.5V; Part_Type: Display; Manufacturer_Part_Number: LG Q396-PS-35; Manufacturer: OSRAM OPTO SEMICONDUCTORS; Alternate_Manufacturer_Part_Number: VLMTG1300-GS08; Alternate_Manufacturer: VISHAY SEMICONDUCTOR OPTO DIVISION; Alternate_Internal_Part_Number: MCD-02400; Part_Preference: Recommended; Provided_By: SUBCO; ID: 3155; ShowFields: YES; Internal_Part_Number: MCD-00588; Status: Released; Package: LED 0603; ComponentLink1Description: Datasheet; ComponentLink1URL: http://tunmcdsvn.tun.st.com/Component_Datasheet_Library/Trunk/Display/OSRAM_LED_GREEN_LG Q396-PS-35; Order_Code_Digikey: LG Q396-PS-35-ND; ECCN_US: n/a; ECCN_EU: n/a; Full_Alternate_Internal_Part_Number: MCD-02400
LNK1-LNK12 = link_200: link 0.2mm; Value: link_200
R35 R36 R39 R45 R47 R53 = MCD-00181: Resistor,0R,0603,ULO; Manufacturer_Part_Number: PMR03EZPJ000; Manufacturer: ROHM; Part_Preference: Recommended; Provided_By: SUBCO; Component_Country_Of_Origin: Philippines, Thailand; ID: 2691; ShowFields: YES; Internal_Part_Number: MCD-00181; Status: Released; Part_Type: Resistor; Package: 0603; ComponentLink1Description: Part_Information; ComponentLink1URL: http://tunmcdsvn.tun.st.com/Component_Documentation_Library/Trunk/Resistor/ROHM_PMR_Series; Order_Code_Digikey: PMR03EZPJ000-ND; Order_Code_Farnell: N/A; Order_Code_RS: N/A; Alternate_Manufacturer: N/A; Alternate_Manufacturer_Part_Number: N/A
R38 R46 R59-R61 = MCD-00052: Resistor,0R,0402,5%,1/16W; Manufacturer_Part_Number: RC0402JR-070RL; Manufacturer: YAGEO; Part_Preference: Recommended; ECCN_US: EAR99; ECCN_EU: NEC; Provided_By: SUBCO; Initial_Board_Reference: mb1274; Order_Code_RS: 618-5804; Internal_Part_Number: MCD-00052; ComponentLink1Description: Datasheet; Status: Released; Part_Type: Resistor; ComponentLink1URL: http://tunmcdsvn.tun.st.com/Component_Documentation_Library/Trunk/Resistor/YAGEO_RC_L_Series; Package: 0402; Alternate_Manufacturer: N/A; Alternate_Manufacturer_Part_Number: N/A; Order_Code_Digikey: 311-0.0JRCT-ND; Order_Code_Farnell: 9232516RL
R41 R54 = MCD-03197: Resistor, 330mR, 0603, +/-1%, 1/5W; Part_Preference: Recommended; Manufacturer: YAGEO; Manufacturer_Part_Number: PT0603FR-7W0R33L; ShowFields: YES; ID: 5313; Internal_Part_Number: MCD-03197; Status: New; Part_Type: Resistor; Package: 0603; ComponentLink1URL: http://tunmcdsvn.tun.st.com/Component_Documentation_Library/Trunk/Resistor/YAGEO_PT_Series; Order_Code_Digikey: PT0603FR-7W0R33L-ND; Order_Code_Farnell: N/A; Order_Code_RS: N/A
R42 R51 = MCD-03229: Resistor, 33mR, 0603, +/-1%, 1/4W; Part_Preference: Recommended; Manufacturer: PANASONIC; Manufacturer_Part_Number: ERJ-3BWFR033V; ShowFields: YES; ID: 5345; Internal_Part_Number: MCD-03229; Status: New; Part_Type: Resistor; Package: 0603; ComponentLink1URL: http://tunmcdsvn.tun.st.com/Component_Documentation_Library/Trunk/Resistor/PANASONIC_ERJ_Series; Order_Code_Digikey: P17467TR-ND; Order_Code_Farnell: 1798582; Order_Code_RS: N/A
R43 R48 = MCD-02234: Resistor,100moHm,0603,1%,1/3W; Part_Preference: Recommended; Manufacturer: PANASONIC; Manufacturer_Part_Number: ERJ-3BWFR100V; Order_Code_RS: 763-8731; Component_Country_Of_Origin: Japan; ID: 4334; ShowFields: YES; Internal_Part_Number: MCD-02234; Status: Checked; Part_Type: Resistor; Alternate_Manufacturer: N/A; Alternate_Manufacturer_Part_Number: N/A; Package: 0603; ComponentLink1Description: Part_Information; ComponentLink1URL: http://tunmcdsvn.tun.st.com/Component_Documentation_Library/Trunk/Resistor/PANASONIC_ERJ_Series; Order_Code_Digikey: P17478CT-ND; Order_Code_Farnell: 1798596
R52 R57 = MCD-00052: Resistor,0R,0402,5%,1/16W; Manufacturer_Part_Number: RC0402JR-070RL; Manufacturer: YAGEO; Part_Preference: Recommended; Order_Code_RS: 618-5804; Component_Country_Of_Origin: China; ID: 2540; ShowFields: YES; Internal_Part_Number: MCD-00052; Status: Released; Part_Type: Resistor; ComponentLink1Description: Part_Information; ComponentLink1URL: http://tunmcdsvn.tun.st.com/Component_Documentation_Library/Trunk/Resistor/YAGEO_RC_L_Series; Package: 0402; Order_Code_Digikey: 311-0.0JRCT-ND; Order_Code_Farnell: 9232516RL; Alternate_Manufacturer: N/A; Alternate_Manufacturer_Part_Number: N/A
R55 R56 R69 = MCD-00056: Resistor,0R,0603,5%,1/10W; Manufacturer_Part_Number: RC0603JR-070RL; Manufacturer: YAGEO; Part_Preference: Recommended; Component_Country_Of_Origin: China; ID: 2536; ShowFields: YES; Internal_Part_Number: MCD-00056; Status: Released; Part_Type: Resistor; ComponentLink1URL: http://tunmcdsvn.tun.st.com/Component_Documentation_Library/Trunk/Resistor/YAGEO_RC_L_Series; Package: 0603; Order_Code_Digikey: 311-0.0GRCT-ND; Order_Code_Farnell: 9233130RL; Order_Code_RS: N/A; Alternate_Manufacturer: N/A; Alternate_Manufacturer_Part_Number: N/A
  R55 R69: ComponentLink1Description: Datasheet
  R56: ComponentLink1Description: Part_Information
R58 = MCD-00181: Resistor, 0R, 0603, +/- 0.5mR, 1/4W; Part_Preference: Recommended; Manufacturer: ROHM; Manufacturer_Part_Number: PMR03EZPJ000; Component_Country_Of_Origin: Philippines, Thailand; ID: 2691; ShowFields: YES; Internal_Part_Number: MCD-00181; Status: Released; Part_Type: Resistor; Alternate_Manufacturer: N/A; Alternate_Manufacturer_Part_Number: N/A; Package: 0603; ComponentLink1URL: http://tunmcdsvn.tun.st.com/Component_Documentation_Library/Trunk/Resistor/ROHM_PMR_Series; Order_Code_Digikey: PMR03EZPJ000-ND; Order_Code_Farnell: N/A; Order_Code_RS: N/A
R62 = MCD-00531: Resistor, 82K, 0402, +/-1%, 1/16W; Part_Preference: Recommended; Manufacturer: YAGEO; Manufacturer_Part_Number: RC0402FR-0782KL; Component_Country_Of_Origin: China; ShowFields: YES; ID: 3207; Internal_Part_Number: MCD-00531; Status: Released; Part_Type: Resistor; Package: 0402; ComponentLink1URL: http://tunmcdsvn.tun.st.com/Component_Documentation_Library/Trunk/Resistor/YAGEO_RC_L_Series; Order_Code_Digikey: 311-82.0KLRCT-ND; Order_Code_Farnell: 9239464; Order_Code_RS: N/A
R65 = MCD-00344: Resistor, 19K6, 0402, +/-1%, 1/16W; Part_Preference: Recommended; Manufacturer: YAGEO; Manufacturer_Part_Number: RC0402FR-0719K6L; Component_Country_Of_Origin: China; ShowFields: YES; ID: 2937; Internal_Part_Number: MCD-00344; Status: Released; Part_Type: Resistor; Package: 0402; ComponentLink1URL: http://tunmcdsvn.tun.st.com/Component_Documentation_Library/Trunk/Resistor/YAGEO_RC_L_Series; Order_Code_Digikey: YAG3026CT-ND; Order_Code_Farnell: N/A; Order_Code_RS: N/A
R204 = MCD-00421: Resistor,20K,0402,1%,1/16W; Part_Preference: Recommended; Manufacturer: YAGEO; Manufacturer_Part_Number: RC0402FR-0720KL; Component_Country_Of_Origin: China; ID: 2858; ShowFields: YES; Internal_Part_Number: MCD-00421; Status: Released; Part_Type: Resistor; Package: 0402; ComponentLink1Description: Part_Information; ComponentLink1URL: http://tunmcdsvn.tun.st.com/Component_Documentation_Library/Trunk/Resistor/YAGEO_RC_L_Series; Order_Code_Digikey: 311-20.0KLRCT-ND; Order_Code_Farnell: 1799191; Order_Code_RS: N/A; Alternate_Manufacturer: N/A; Alternate_Manufacturer_Part_Number: N/A
R208 = MCD-00367: Resistor,110K,0402,1%,1/16W; Manufacturer_Part_Number: RC0402FR-07110KL; Manufacturer: YAGEO; Part_Preference: Recommended; Component_Country_Of_Origin: China; ID: 2912; ShowFields: YES; Internal_Part_Number: MCD-00367; Status: Released; Part_Type: Resistor; Package: 0402; ComponentLink1Description: Part_Information; ComponentLink1URL: http://tunmcdsvn.tun.st.com/Component_Documentation_Library/Trunk/Resistor/YAGEO_RC_L_Series; Order_Code_Digikey: 311-110KLRCT-ND; Order_Code_Farnell: 1458740; Order_Code_RS: N/A; Alternate_Manufacturer: N/A; Alternate_Manufacturer_Part_Number: N/A
R210 = MCD-00441: Resistor,270R,0402,1%,1/16W; Manufacturer_Part_Number: RC0402FR-07270RL; Manufacturer: YAGEO; Part_Preference: Recommended; Provided_By: SUBCO; ECCN_US: EAR99; ECCN_EU: NEC; ID: 2838; ShowFields: YES; Internal_Part_Number: MCD-00441; Status: Released; Part_Type: Resistor; Package: 0402; ComponentLink1Description: Datasheet; ComponentLink1URL: http://tunmcdsvn.tun.st.com/Component_Documentation_Library/Trunk/Resistor/YAGEO_RC_L_Series; Order_Code_Digikey: 311-270LRCT-ND; Order_Code_Farnell: 9239162; Order_Code_RS: N/A
TP8 = MCD-00713: Vero Technologies 1.02mm Black Terminal Post; Part_Type: Misc; Manufacturer_Part_Number: 20-2137; Part_Preference: Recommended; Order_Code_RS: 101-2391; Component_Country_Of_Origin: United Kingdom; ID: 3032; ShowFields: YES; Internal_Part_Number: MCD-00713; Status: Released; Manufacturer: VERO; ComponentLink1URL: http://tunmcdsvn.tun.st.com/Component_Datasheet_Library/Trunk/Misc/Vero_TestPin_20-2137
U26 = MCD-03000: Part_Type: IC; Part_Preference: Recommended; Manufacturer: STMICROELECTRONICS; Component_Country_Of_Origin: Unknown; ShowFields: YES; ID: 5116; ComponentLink1Description: Datasheet; ComponentLink1URL: http://tunmcdsvn.tun.st.com/Component_Documentation_Library/Trunk/IC/STMICROELECTRONICS_STPMIC2; Internal_Part_Number: MCD-03000; Status: Checked; Manufacturer_Part_Number: STPMIC25A; Package: VQFN; Order_Code_Digikey: N/A; Order_Code_Farnell: N/A; Order_Code_RS: N/A
U30 = MCD-00581: LDO Linear Voltage Regulator IC Positive Adjustable 1 Output Adjustable 1.3A 6-DFN (3x3); BMS_Part_Number: 9176239; Part_Preference: Recommended; Manufacturer: STMICROELECTRONICS; Manufacturer_HQ_COO: EU; Component_Country_Of_Origin: Malaysia; ShowFields: YES; ID: 3163; Internal_Part_Number: MCD-00581; Value: ST1L05BPUR; Status: Released; Part_Type: IC; Manufacturer_Part_Number: ST1L05BPUR; Package: DFN6 (3x3); ComponentLink1URL: http://tunmcdsvn.tun.st.com/Component_Datasheet_Library/Trunk/IC/STM_LDO_ST1L05BPUR
U37 = MCD-02219: 3 A DC step-down switching regulator; Part_Preference: Recommended; Part_Type: IC; Manufacturer: STMICROELECTRONICS; Manufacturer_HQ_COO: EU; Order_Code_RS: NA; Component_Country_Of_Origin: Malaysia; ID: 4319; ShowFields: YES; Internal_Part_Number: MCD-02219; Status: Checked; Manufacturer_Part_Number: ST1S40IPUR; Package: VFQFPN; ComponentLink1URL: http://tunmcdsvn.tun.st.com/Component_Datasheet_Library/Trunk/IC/STM_Buck_converter_ST1S40IPUR; Order_Code_Digikey: 497-12084-1-ND; Order_Code_Farnell: NA; Value: ST1S40IPUR

## Sheet Expansion _&_mikroBUS_Connectors.SchDoc: EXPANSION_&_mikroBUS_ Connectors
size A3; CompanyName: STMicroelectronics; Organization: Microcontrollers Division; Address1: 12, Rue Jules HOROWITZ; Address2: 38019 Grenoble; Address3: FRANCE; Revision: A-01; SheetNumber: 16; SheetTotal: 18; DocumentName: ARDUINO_ Connectors.SchDoc
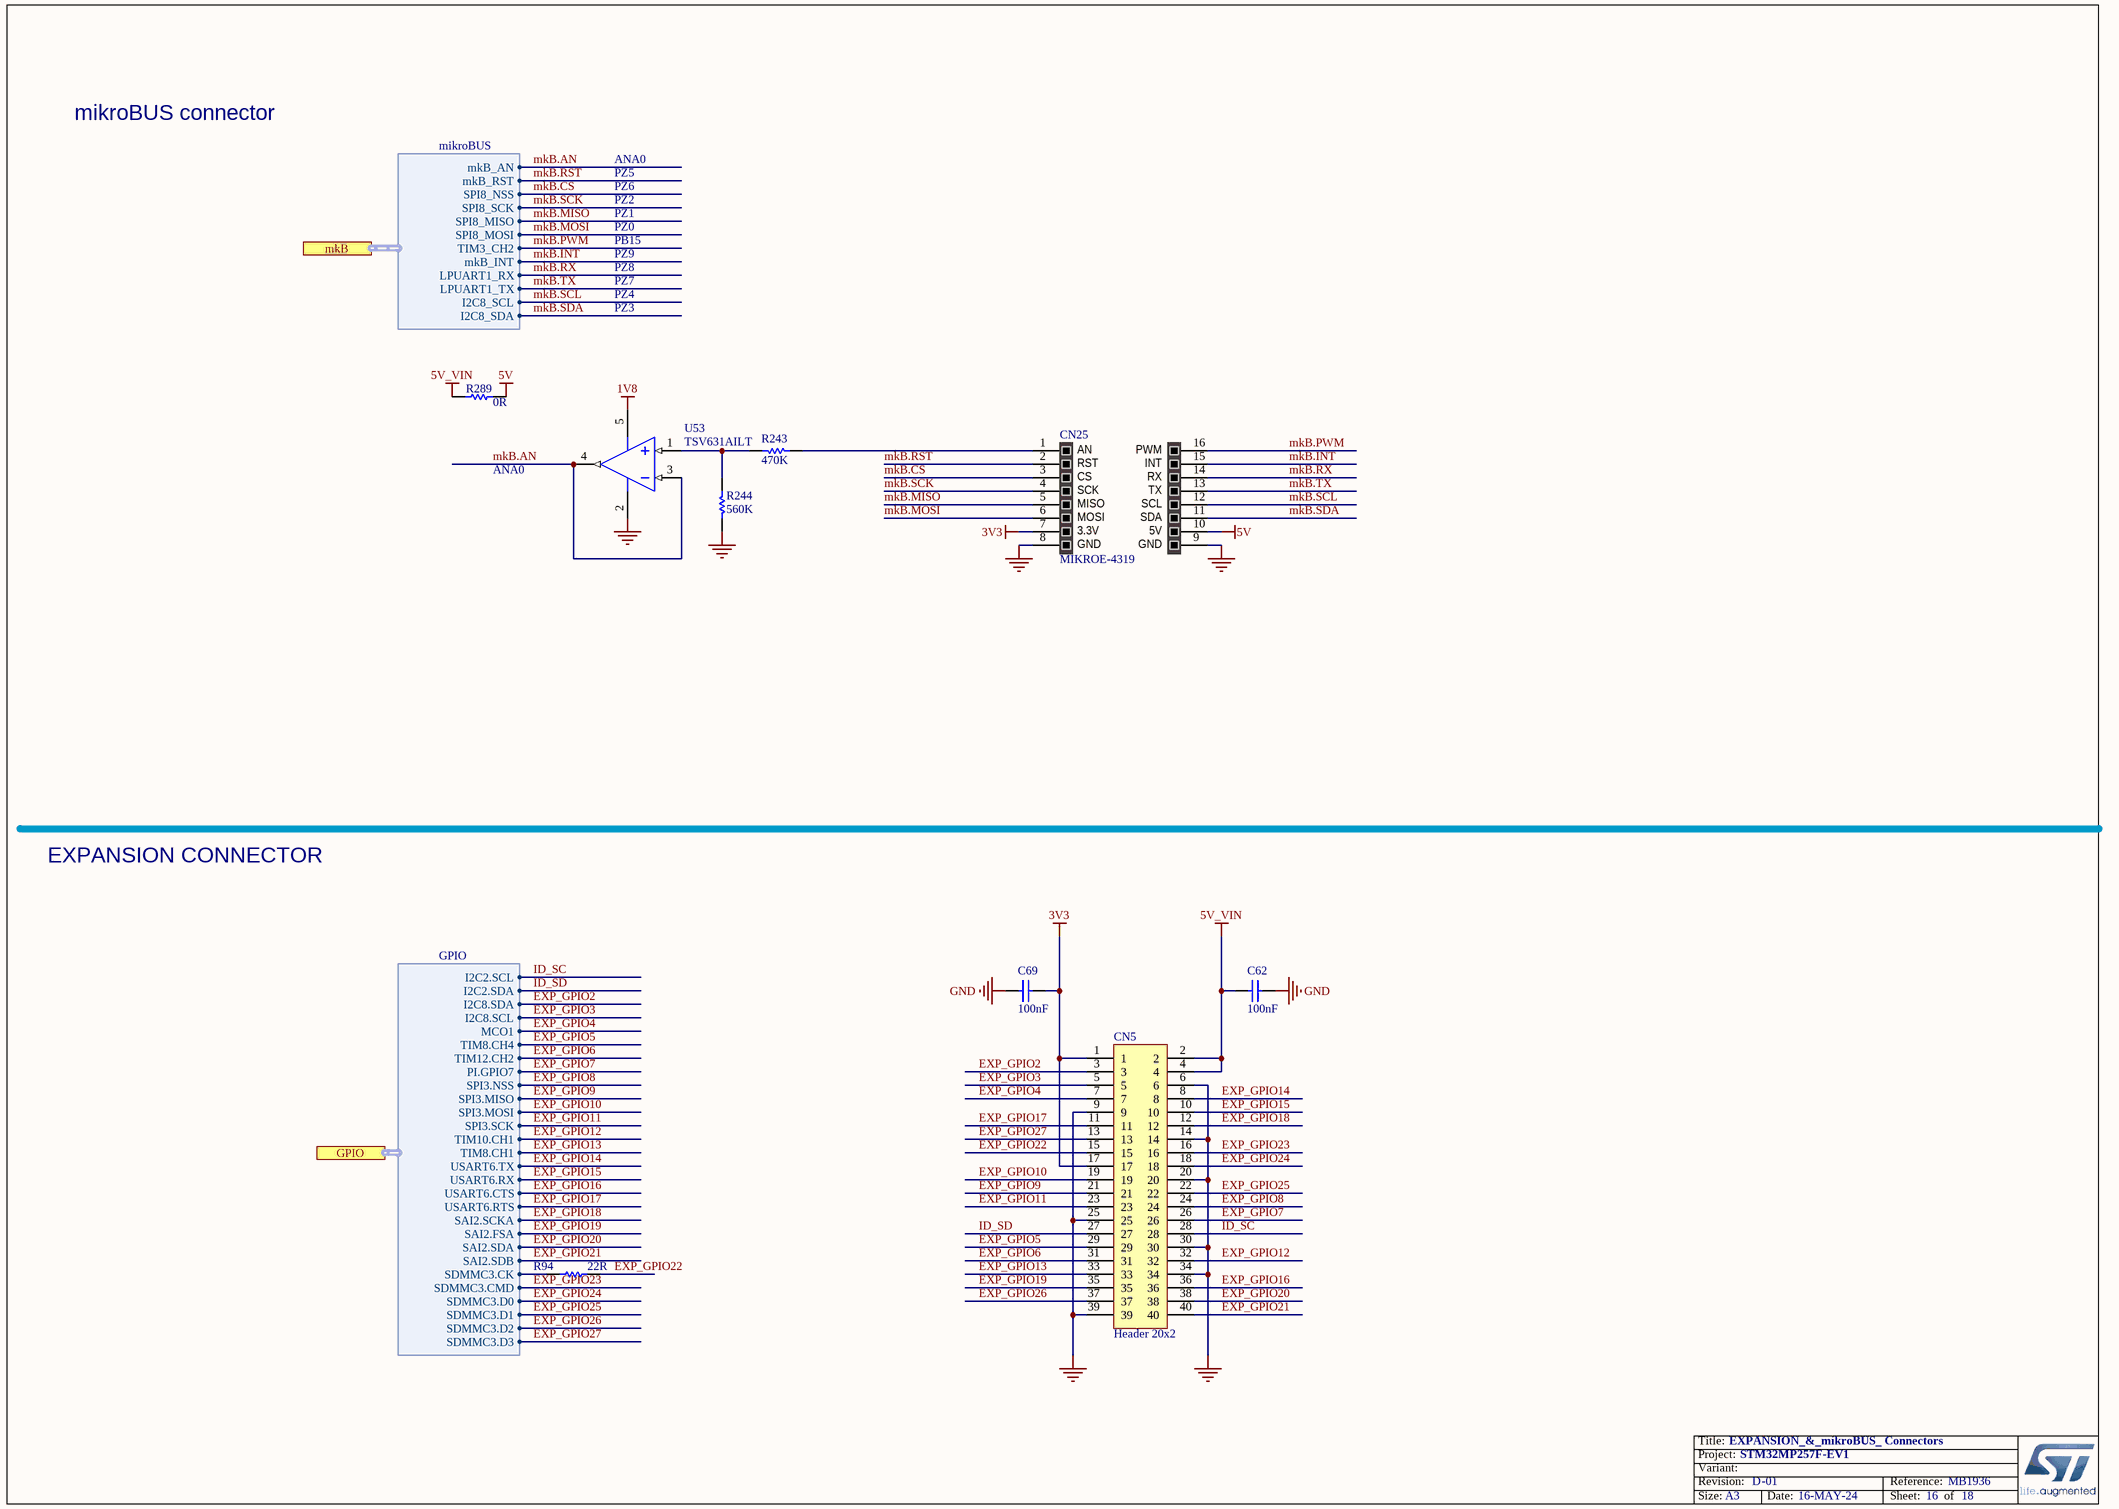
[diagram p17: Expansion _&_mikroBUS_Connectors.SchDoc]

### Parts
C62  value 100nF  [C0402]  (hidden comment: Capacitor)
C69  value 100nF  [C0402]  (hidden comment: Capacitor)
CN5  Header 20x2  [CON_SAMTEC_TSW-120-07-G-D]
CN25  MIKROE-4319  [SOCKET_MIKROBUS_MIKROE-4319_SMD_P254]
R94  value 22R  [R0201_H0P23]  (hidden comment: Resistor)
R243  value 470K  [R0402]  (hidden comment: Resistor)
R244  value 560K  [R0402]  (hidden comment: Resistor)
R289  value 0R  [R0402]
U53  TSV631AILT  [AOP_SOT23-5L_H1P45]

### Ports
GPIO (harness GPIO), mkB (harness mikroBUS)

### Harnesses
GPIO: I2C2.SCL, I2C2.SDA, I2C8.SDA, MCO1, TIM8.CH4, TIM12.CH2, PI.GPIO7, SPI3.NSS, SPI3.MISO, SPI3.MOSI, SPI3.SCK, TIM10.CH1, TIM8.CH1, USART6.TX, USART6.RX, USART6.CTS, USART6.RTS, SDMMC3.CK, SDMMC3.CMD, SDMMC3.D0, SDMMC3.D1, SDMMC3.D2, SDMMC3.D3, I2C8.SCL, SAI2.SCKA, SAI2.FSA, SAI2.SDA, SAI2.SDB
mikroBUS: I2C8_SDA, SPI8_NSS, SPI8_MISO, SPI8_MOSI, SPI8_SCK, TIM3_CH2, LPUART1_RX, I2C8_SCL, LPUART1_TX, mkB_INT, mkB_RST, mkB_AN

### Nets
1V8: U53.5(VCC)
3V3: C69.1 CN5.1 CN5.17 CN25.7
5V: CN25.10 R289.2
5V_VIN: C62.2 CN5.2 CN5.4 R289.1
GND: C62.1 C69.2 CN5.6 CN5.9 CN5.14 CN5.20 CN5.25 CN5.30 CN5.34 CN5.39 CN25.8 CN25.9 R244.1 U53.2(VDD)
EXP_GPIO2: CN5.3 CN25.11 ; port GPIO.I2C8.SDA, port mkB.I2C8_SDA  [also labelled mkB.SDA]
EXP_GPIO3: CN5.5 CN25.12 ; port GPIO.I2C8.SCL, port mkB.I2C8_SCL  [also labelled mkB.SCL]
EXP_GPIO4: CN5.7 ; port GPIO.MCO1
EXP_GPIO5: CN5.29 ; port GPIO.TIM8.CH4
EXP_GPIO6: CN5.31 ; port GPIO.TIM12.CH2
EXP_GPIO7: CN5.26 ; port GPIO.PI.GPIO7
EXP_GPIO8: CN5.24 ; port GPIO.SPI3.NSS
EXP_GPIO9: CN5.21 ; port GPIO.SPI3.MISO
EXP_GPIO10: CN5.19 ; port GPIO.SPI3.MOSI
EXP_GPIO11: CN5.23 ; port GPIO.SPI3.SCK
EXP_GPIO12: CN5.32 ; port GPIO.TIM10.CH1
EXP_GPIO13: CN5.33 ; port GPIO.TIM8.CH1
EXP_GPIO14: CN5.8 ; port GPIO.USART6.TX
EXP_GPIO15: CN5.10 ; port GPIO.USART6.RX
EXP_GPIO16: CN5.36 ; port GPIO.USART6.CTS
EXP_GPIO17: CN5.11 ; port GPIO.USART6.RTS
EXP_GPIO18: CN5.12 ; port GPIO.SAI2.SCKA
EXP_GPIO19: CN5.35 ; port GPIO.SAI2.FSA
EXP_GPIO20: CN5.38 ; port GPIO.SAI2.SDA
EXP_GPIO21: CN5.40 ; port GPIO.SAI2.SDB
EXP_GPIO22: CN5.15 R94.2
EXP_GPIO23: CN5.16 ; port GPIO.SDMMC3.CMD
EXP_GPIO24: CN5.18 ; port GPIO.SDMMC3.D0
EXP_GPIO25: CN5.22 ; port GPIO.SDMMC3.D1
EXP_GPIO26: CN5.37 ; port GPIO.SDMMC3.D2
EXP_GPIO27: CN5.13 ; port GPIO.SDMMC3.D3
GPIO.SDMMC3_CK: R94.1 ; port GPIO.SDMMC3.CK
ID_SC: CN5.28 ; port GPIO.I2C2.SCL  [project net I2C2.SCL]
ID_SD: CN5.27 ; port GPIO.I2C2.SDA  [project net I2C2.SDA]
mkB.AN: U53.3(IN-) U53.4(OUT) ; port mkB.mkB_AN
mkB.CS: CN25.3 ; port mkB.SPI8_NSS
mkB.INT: CN25.15 ; port mkB.mkB_INT
mkB.MISO: CN25.5 ; port mkB.SPI8_MISO
mkB.MOSI: CN25.6 ; port mkB.SPI8_MOSI
mkB.PWM: CN25.16 ; port mkB.TIM3_CH2
mkB.RST: CN25.2 ; port mkB.mkB_RST
mkB.RX: CN25.14 ; port mkB.LPUART1_RX
mkB.SCK: CN25.4 ; port mkB.SPI8_SCK
mkB.TX: CN25.13 ; port mkB.LPUART1_TX
NetCN25_1: CN25.1 R243.1
NetR243_2: R243.2 R244.2 U53.1(IN+)

### Notes on the sheet
- mikroBUS connector
- ANA0
- PZ5
- PZ6
- PZ2
- PZ1
- PZ0
- PB15
- PZ9
- PZ8
- PZ7
- PZ4
- PZ3
- EXPANSION CONNECTOR
- Title:
- Project:
- Size:
- Revision:
- Variant:
- A3
- -
- Date:
- Reference:
- Sheet:
- of
- (in symbol MCD-03517) AN; PWM; RST; INT; CS; RX; SCK; TX; MISO; SCL; MOSI; SDA; 3.3V; 5V; GND

### Library data of the parts
C62 C69 = MCD-00006: Capacitor, MLCC, 100nF, 16V, X7R, +/-10%, 0402, T=0.5mm; Part_Preference: Recommended; Manufacturer: YAGEO; Manufacturer_Part_Number: CC0402KRX7R7BB104; Order_Code_RS: 616-9701; Component_Country_Of_Origin: China; ShowFields: YES; ID: 2474; Internal_Part_Number: MCD-00006; Status: Released; Part_Type: Capacitor; Package: 0402; ComponentLink1URL: http://tunmcdsvn.tun.st.com/Component_Documentation_Library/Trunk/Capacitor/YAGEO_X7R_Series; Order_Code_Digikey: 311-1338-1-ND; Order_Code_Farnell: 9402047
CN5 = MCD-00302: Header, 20x2, 2.54mm, VR, TH, T=5.84mm/2.54mm; Manufacturer_Part_Number: TSW-120-07-G-D; Manufacturer: SAMTEC; Part_Type: Connector; Part_Preference: Recommended; Order_Code_RS: 180-2456; Component_Country_Of_Origin: China, Costa Rica, Malaysia, United States, Vietnam; ShowFields: YES; ID: 2567; Internal_Part_Number: MCD-00302; Value: Header 20x2; ComponentLink1URL: http://tunmcdsvn.tun.st.com/Component_Documentation_Library/Trunk/Connector/SAMTEC_TSW_Series/; Status: Released; Order_Code_Digikey: SAM1028-20-ND; Order_Code_Farnell: 2779689
CN25 = MCD-03517: Socket , mikroBUS , 16 , SMD , Gray; Part_Type: Connector; Part_Preference: Recommended; Manufacturer: MIKROE; Component_Country_Of_Origin: Serbia; ShowFields: YES; ID: 5633; Internal_Part_Number: MCD-03517; Value: MIKROE-4319; Status: Checked; Manufacturer_Part_Number: MIKROE-4319; ComponentLink1URL: http://tunmcdsvn.tun.st.com/Component_Documentation_Library/Trunk/Connector/MIKROE_4319; Order_Code_Digikey: 1471-MIKROE-4319-ND; Order_Code_Farnell: N/A; Order_Code_RS: N/A
R94 = MCD-02978: Resistor, 22R, 0201, +/-1%, 1/20W; Manufacturer_Part_Number: RC0201FR-0722RL; Manufacturer: YAGEO; Part_Preference: Recommended; Order_Code_RS: 198-7593; ID: 5094; ShowFields: YES; Internal_Part_Number: MCD-02978; Status: New; Part_Type: Resistor; ComponentLink1URL: http://tunmcdsvn.tun.st.com/Component_Documentation_Library/Trunk/Resistor/YAGEO_RC_L_Series; Package: 0201; Order_Code_Digikey: YAG2518TR-ND; Order_Code_Farnell: 2693564
R243 = MCD-00483: Resistor, 470K, 0402, +/-1%, 1/16W; Part_Preference: Recommended; Manufacturer: YAGEO; Manufacturer_Part_Number: RC0402FR-07470KL; Component_Country_Of_Origin: China; ShowFields: YES; ID: 2797; Internal_Part_Number: MCD-00483; Status: Released; Part_Type: Resistor; Package: 0402; ComponentLink1URL: http://tunmcdsvn.tun.st.com/Component_Documentation_Library/Trunk/Resistor/YAGEO_RC_L_Series; Order_Code_Digikey: 311-470KLRCT-ND; Order_Code_Farnell: 9239553; Order_Code_RS: N/A
R244 = MCD-00495: Resistor, 560K, 0402, +/-1%, 1/16W; Part_Preference: Recommended; Manufacturer: YAGEO; Manufacturer_Part_Number: RC0402FR-07560KL; Component_Country_Of_Origin: China; ShowFields: YES; ID: 2779; Internal_Part_Number: MCD-00495; Status: Released; Part_Type: Resistor; Package: 0402; ComponentLink1URL: http://tunmcdsvn.tun.st.com/Component_Documentation_Library/Trunk/Resistor/YAGEO_RC_L_Series; Order_Code_Digikey: 311-560KLRCT-ND; Order_Code_Farnell: 1458810; Order_Code_RS: N/A
R289 = MCD-00052: Resistor,0R,0402,5%,1/16W; Manufacturer_Part_Number: RC0402JR-070RL; Manufacturer: YAGEO; Part_Preference: Recommended; Provided_By: SUBCO; Initial_Board_Reference: mb1274; Order_Code_RS: 618-5804; Component_Country_Of_Origin: China; ID: 2540; ShowFields: YES; Internal_Part_Number: MCD-00052; ComponentLink1Description: Datasheet; ECCN_US: n/a; ECCN_EU: n/a; Status: Released; Part_Type: Resistor; ComponentLink1URL: http://tunmcdsvn.tun.st.com/Component_Documentation_Library/Trunk/Resistor/YAGEO_RC_L_Series; Package: 0402; Order_Code_Digikey: 311-0.0JRCT-ND; Order_Code_Farnell: 9232516RL
U53 = MCD-02043: Single,  rail to rail input/ouput 880Khz operational amplifiers; Part_Type: IC; Part_Preference: Recommended; Manufacturer: STMICROELECTRONICS; Manufacturer_HQ_COO: EU; Order_Code_RS: 189-2129; Component_Country_Of_Origin: Malaysia; ShowFields: YES; ID: 4143; Internal_Part_Number: MCD-02043; Value: TSV631AILT; Status: Checked; Manufacturer_Part_Number: TSV631AILT; Package: SOT23-5; ComponentLink1URL: http://tunmcdsvn.tun.st.com/Component_Documentation_Library/Trunk/IC/STMICROELECTRONICS_TSV631AILT; Order_Code_Digikey: 497-8542-1-ND; Order_Code_Farnell: 1737209